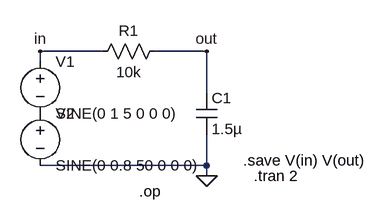
[diagram p0: schematic Draft3.asc]
Draft3.asc, the LTspice schematic file:
Version 4
SHEET 1 1256 680
WIRE 256 -16 160 -16
WIRE 416 -16 336 -16
WIRE 160 0 160 -16
WIRE 416 48 416 -16
WIRE 416 160 416 112
WIRE 416 160 160 160
WIRE 416 176 416 160
FLAG 416 176 0
FLAG 416 -16 out
FLAG 160 -16 in
SYMBOL res 352 -32 R90
WINDOW 0 0 56 VBottom 2
WINDOW 3 32 56 VTop 2
SYMATTR InstName R1
SYMATTR Value 10k
SYMBOL cap 400 48 R0
SYMATTR InstName C1
SYMATTR Value 1.5µ
SYMBOL voltage 160 -16 R0
SYMATTR InstName V1
SYMATTR Value SINE(0 1 5 0 0 0)
SYMBOL voltage 160 64 R0
SYMATTR InstName V2
SYMATTR Value SINE(0 0.8 50 0 0 0)
TEXT 312 200 Left 2 !.op
TEXT 488 176 Left 2 !.tran 2
TEXT 472 152 Left 2 !.save V(in) V(out)

The netlist it stands for:
* Draft3.asc
R1 out in 10k
C1 out 0 1.5µ
V1 in P001 SINE(0 1 5 0 0 0)
V2 P001 0 SINE(0 0.8 50 0 0 0)
.op
.tran 2
.save V(in) V(out)
.backanno
.end